# Altium schematic sheet reg.SchDoc
size A
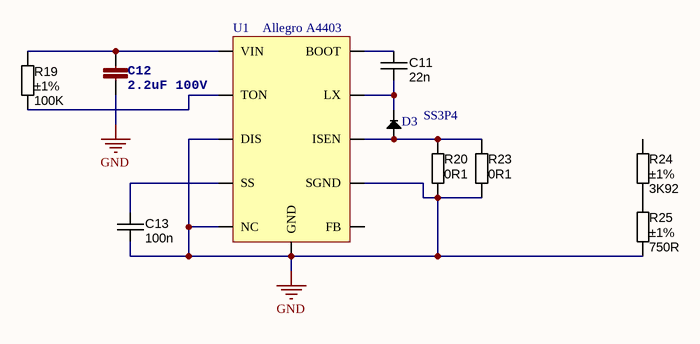
[diagram p0: reg.SchDoc]

## Parts
C11  value 22n  [CAPC1608X90N]  (hidden comment: approved sub OK)
C12  2.2uF 100V  [1210]
C13  value 100n  [CAPC1608X90N]  (hidden comment: approved sub OK)
D3  SS3P4  [SS3P4]
R19  value 100K  Tolerance: ±1%  [RESC2012X70N]  (hidden comment: Thick Film)
R20  value 0R1  [RESC3216X70N]  (hidden comment: RES_NL_1206)  (no BOM)
R23  value 0R1  [RESC3216X70N]  (hidden comment: RES_NL_1206)  (no BOM)
R24  value 3K92  Tolerance: ±1%  [RESC2012X70N]  (hidden comment: Thick Film)
R25  value 750R  Tolerance: ±1%  [RESC2012X70N]  (hidden comment: Thick Film)
U1  Allegro A4403

## Nets
GND: C12.2 C13.2 R20.1 R23.1 R25.2 U1.DIS U1.GND U1.NC U1.SGND
NetC11_1: C11.1 U1.BOOT
NetC11_2: C11.2 D3.2 U1.LX
NetC12_1: C12.1 R19.1 U1.VIN
NetC13_1: C13.1 U1.SS
NetD3_1: D3.1 R20.2 R23.2 U1.ISEN
NetR19_2: R19.2 U1.TON
NetR24_2: R24.2 R25.1

Not connected (* = marked no-connect by the designer): R24 1; U1 FB

## Library data of the parts
C11 C13 = CAPC_100n_0603_X7R_50V_10%: Capacitor SMD Cer 100nF 10% 50V X7R 0603; Manufacturer 1: AVX Corporation; Manufacturer Part Number 1: 06035C104KAT2A; Ratings: 50V; X7R; Material: ceramic; SCDType: spec; Manufacturer 2: TDK Corporation; Manufacturer Part Number 2: C1608X7R1H104K; Package / Case: 0603 (1608 Metric); Tolerance: ±10%; Supplier 1: Digi-Key; Supplier Part Number 1: 478-5052-1-ND; ComponentLink1URL: http://www.avx.com/docs/Catalogs/cx7r.pdf; ComponentLink1Description: http://www.avx.com/docs/Catalogs/cx7r.pdf; Supplier 2: Digi-Key; Supplier Part Number 2: 445-1314-1-ND; ComponentLink2URL: http://product.tdk.com/capacitor/mlcc/en/documents/mlcc_commercial_general_en.pdf; ComponentLink2Description: http://product.tdk.com/capacitor/mlcc/en/documents/mlcc_commercial_general_en.pdf
C12 = 10UF50V20%(1210): PROD_ID: CAP-09824; Digikey: 587-1778-1-ND
R19 R24 R25 = RES_4K7_0805_1%: Resistor SMD chip 4.7k Ohm 0.125W 1% 0805; Manufacturer 1: Vishay/Dale; Manufacturer Part Number 1: CRCW08054K70FKEA; Ratings: 1/8W; SCDType: spec; Package / Case: 0805 (2012 metric); Supplier 1: Digi-Key; Supplier Part Number 1: 541-4.70KCCT-ND
R20 R23 = RES_NL_1206: Resistor, SMD chip; Package / Case: 1206 (3216 metric)
U1 = A4403 Allegro Buck Regulator